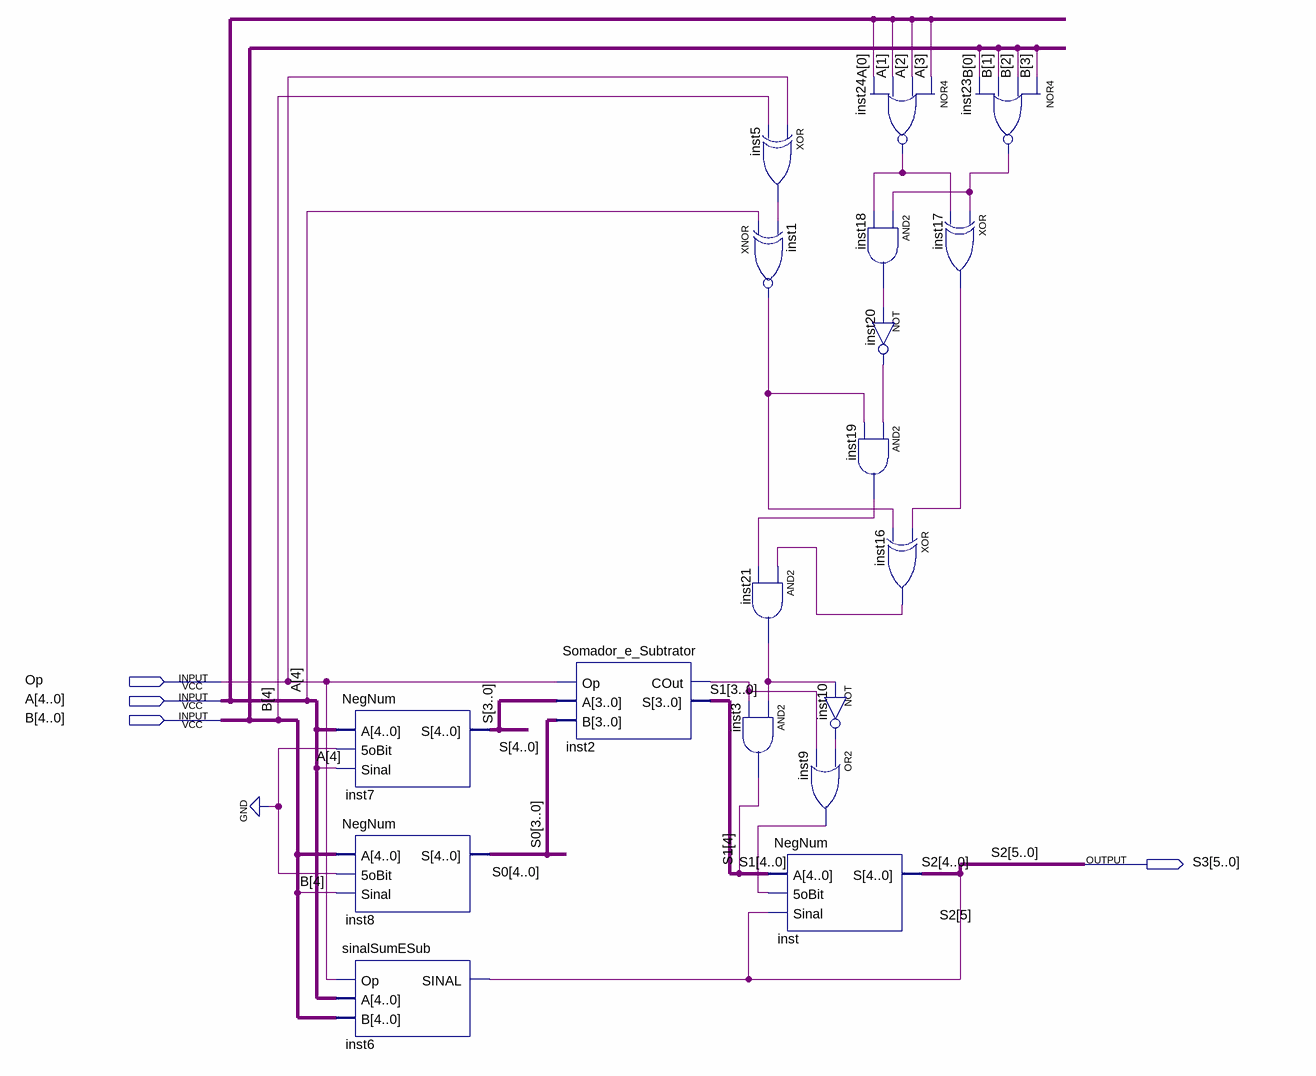
[diagram p0: schematic sheet]
// Quartus schematic SumESub.bdf as structural Verilog: 18 symbols, 4 pins
module SumESub (
  input  Op,
  input  [4:0] A,
  input  [4:0] B,
  output [5:0] S3
);

  wire inst1_out, inst2_cout, inst5_out, inst9_out, inst10_out, inst16_out, inst17_out, inst18_out,
       inst19_out, inst20_out, inst21_out, inst23_out, inst24_out;
  wire [4:0] S, S0, S1;

  NegNum inst7 (.A(A), .\5oBit (1'b0), .Sinal(A[4]), .S(S));
  NegNum inst8 (.A(B), .\5oBit (1'b0), .Sinal(B[4]), .S(S0));
  sinalSumESub inst6 (.Op(Op), .A(A), .B(B), .SINAL(S3[5]));
  Somador_e_Subtrator inst2 (.Op(Op), .A(S[3:0]), .B(S0[3:0]), .COut(inst2_cout), .S(S1[3:0]));
  xor inst5 (inst5_out, Op, B[4]);
  xnor inst1 (inst1_out, A[4], inst5_out);
  and inst21 (inst21_out, inst16_out, inst19_out);
  and inst3 (S1[4], inst21_out, inst2_cout);
  not inst10 (inst10_out, inst21_out);
  or inst9 (inst9_out, inst10_out, inst2_cout);
  NegNum inst (.A(S1), .\5oBit (inst9_out), .Sinal(S3[5]), .S(S3[4:0]));
  nor inst24 (inst24_out, A[3], A[2], A[1], A[0]);
  and inst18 (inst18_out, inst23_out, inst24_out);
  not inst20 (inst20_out, inst18_out);
  and inst19 (inst19_out, inst20_out, inst1_out);
  xor inst16 (inst16_out, inst17_out, inst1_out);
  nor inst23 (inst23_out, B[3], B[2], B[1], B[0]);
  xor inst17 (inst17_out, inst23_out, inst24_out);

  // Other names for the same wires on the sheet: S2[5:0] = S3
endmodule
